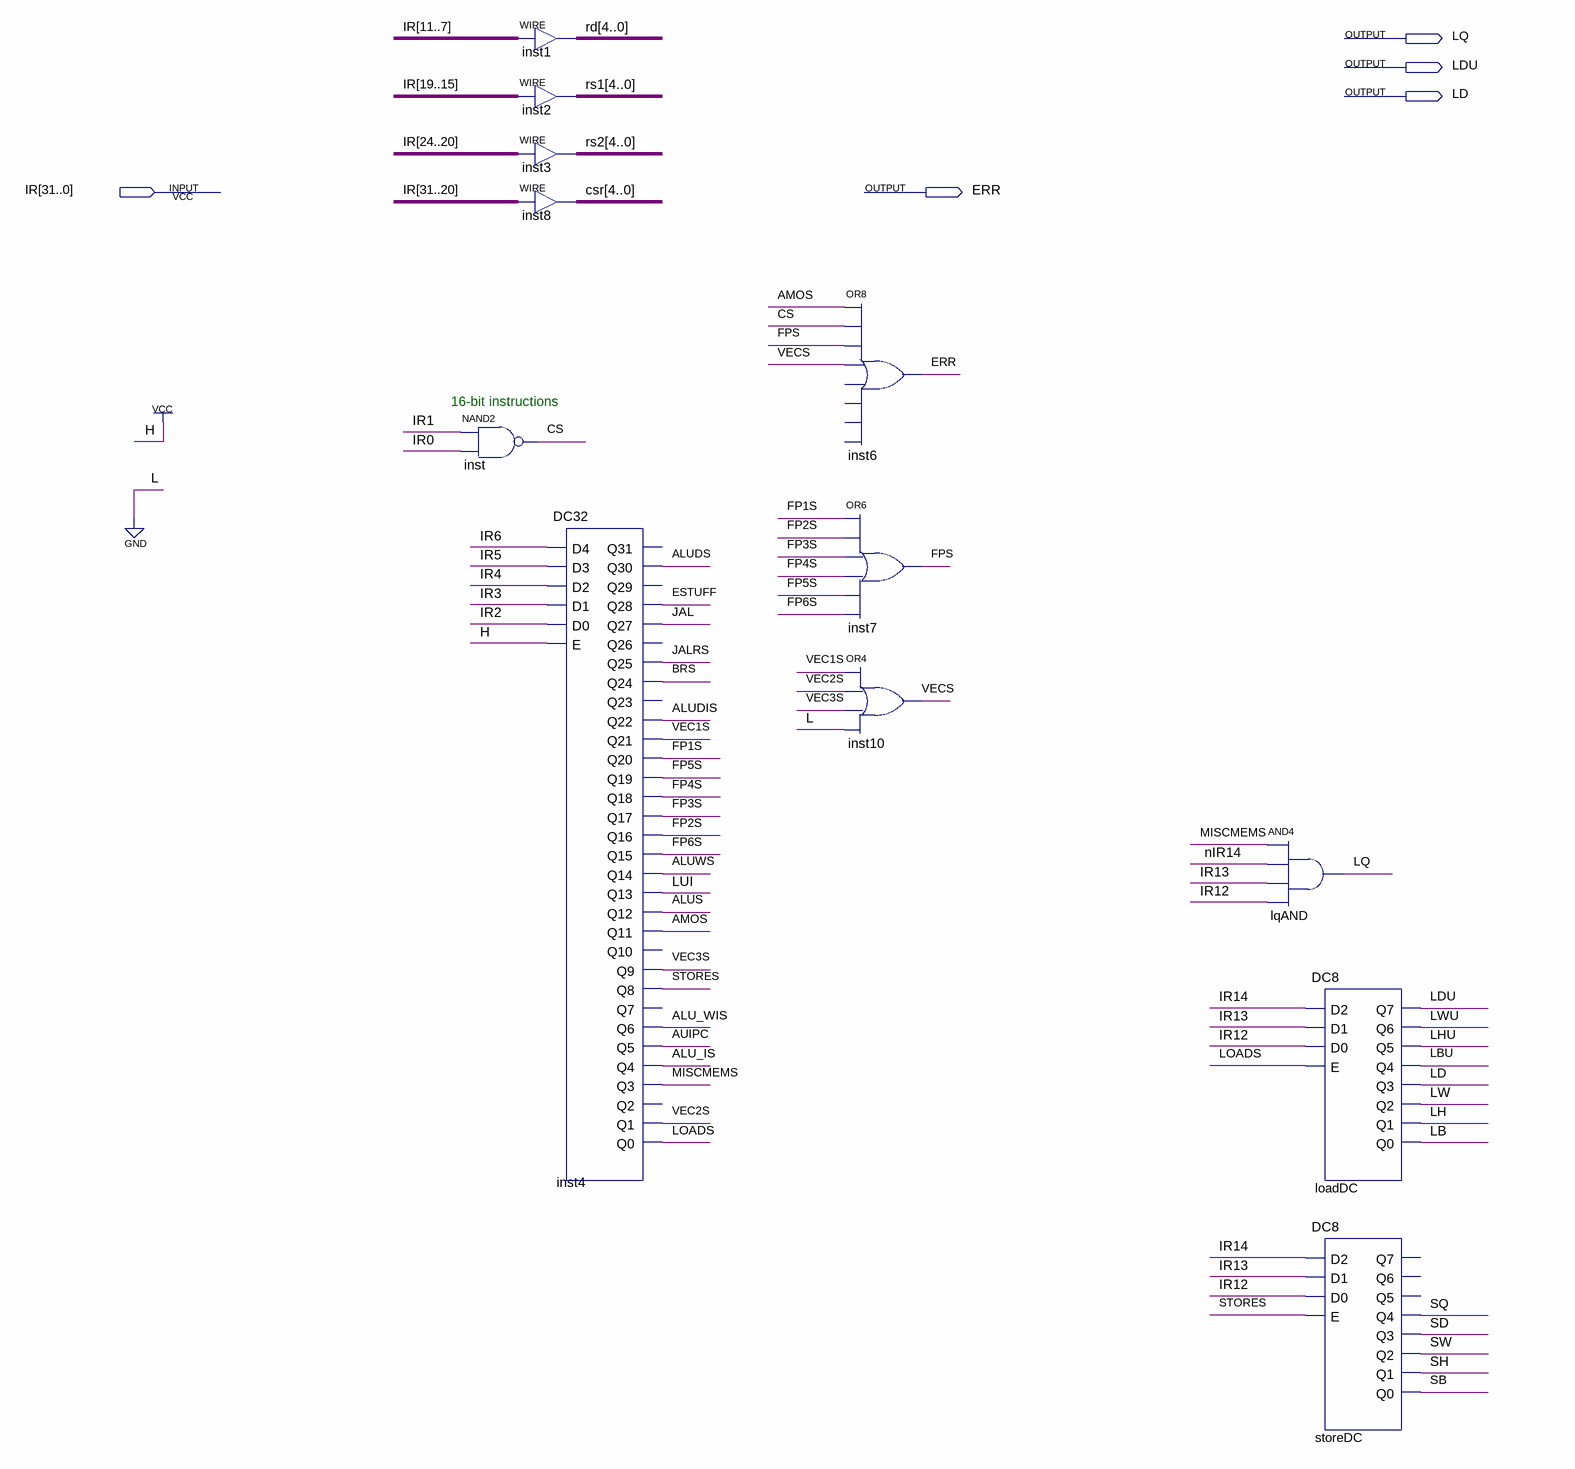
[diagram p0: schematic sheet]
// Quartus schematic Core_InsDecoder.bdf as structural Verilog: 12 symbols, 5 pins
module Core_InsDecoder (
  input  [31:0] IR,
  output LQ,
  output LDU,
  output LD,
  output ERR
);

  wire ALU_IS, ALU_WIS, ALUDIS, ALUDS, ALUS, ALUWS, AMOS, AUIPC, BRS, CS, ESTUFF, FP1S, FP2S, FP3S, FP4S,
       FP5S, FP6S, FPS, JAL, JALRS, LB, LBU, LH, LHU, LOADS, LUI, LW, LWU, MISCMEMS, nIR14, SB, SD, SH, SQ,
       STORES, SW, VEC1S, VEC2S, VEC3S, VECS;
  wire [4:0] csr, rd, rs1, rs2;

  assign rd = IR[11:7];  // WIRE inst1
  assign rs1 = IR[19:15];  // WIRE inst2
  assign rs2 = IR[24:20];  // WIRE inst3
  assign csr = IR[31:20];  // WIRE inst8
  nand inst (CS, IR[1], IR[0]);
  DC32 inst4 (
    .D4(IR[6]), .D3(IR[5]), .D2(IR[4]), .D1(IR[3]), .D0(IR[2]), .E(1'b1), .Q30(ALUDS), .Q28(ESTUFF),
    .Q27(JAL), .Q25(JALRS), .Q24(BRS), .Q22(ALUDIS), .Q21(VEC1S), .Q20(FP1S), .Q19(FP5S), .Q18(FP4S),
    .Q17(FP3S), .Q16(FP2S), .Q15(FP6S), .Q14(ALUWS), .Q13(LUI), .Q12(ALUS), .Q11(AMOS), .Q9(VEC3S),
    .Q8(STORES), .Q6(ALU_WIS), .Q5(AUIPC), .Q4(ALU_IS), .Q3(MISCMEMS), .Q1(VEC2S), .Q0(LOADS));  // open: Q31, Q29, Q26, Q23, Q10, Q7, Q2
  or inst6 (ERR, AMOS, CS, FPS, VECS);  // open: IN5, IN6, IN7, IN8
  or inst7 (FPS, FP1S, FP2S, FP3S, FP4S, FP5S, FP6S);
  or inst10 (VECS, VEC1S, VEC2S, VEC3S, 1'b0);
  and lqAND (LQ, MISCMEMS, nIR14, IR[13], IR[12]);
  DC8 loadDC (
    .D2(IR[14]), .D1(IR[13]), .D0(IR[12]), .E(LOADS), .Q7(LDU), .Q6(LWU), .Q5(LHU), .Q4(LBU), .Q3(LD),
    .Q2(LW), .Q1(LH), .Q0(LB));
  DC8 storeDC (
    .D2(IR[14]), .D1(IR[13]), .D0(IR[12]), .E(STORES), .Q4(SQ), .Q3(SD), .Q2(SW), .Q1(SH), .Q0(SB));  // open: Q7, Q6, Q5

  // Notes on the sheet:
  //   16-bit instructions
endmodule
